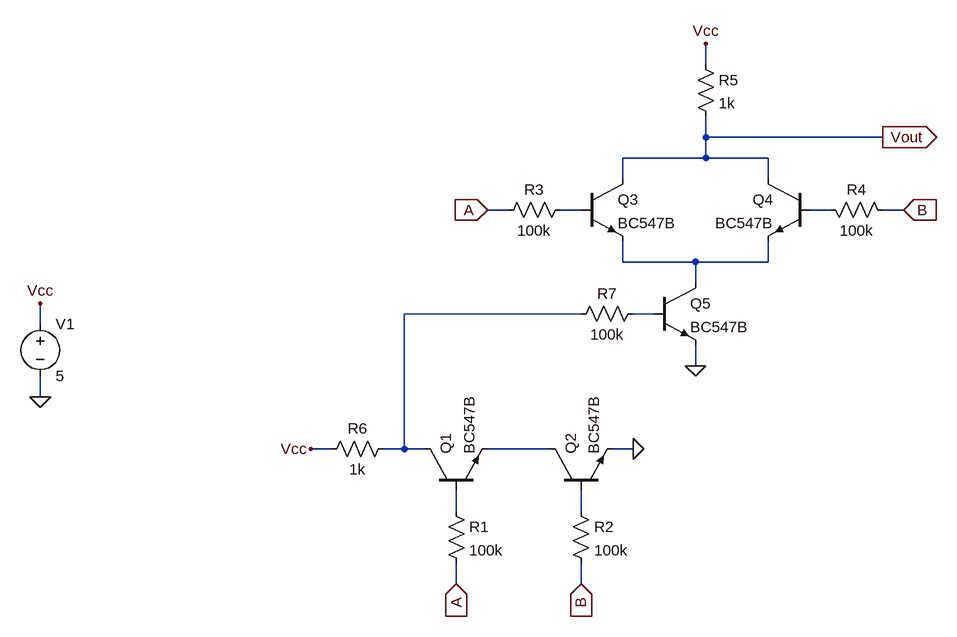
[diagram p0: schematic XNORgate.asc]
XNORgate.asc, the LTspice schematic file:
Version 4
SHEET 1 896 680
WIRE 496 -464 496 -496
WIRE 496 -352 496 -384
WIRE 768 -352 496 -352
WIRE 496 -320 496 -352
WIRE 496 -320 368 -320
WIRE 592 -320 496 -320
WIRE 368 -288 368 -320
WIRE 592 -288 592 -320
WIRE 192 -240 160 -240
WIRE 304 -240 272 -240
WIRE 688 -240 656 -240
WIRE 800 -240 768 -240
WIRE 368 -160 368 -192
WIRE 480 -160 368 -160
WIRE 592 -160 592 -192
WIRE 592 -160 480 -160
WIRE 480 -128 480 -160
WIRE 304 -80 32 -80
WIRE 416 -80 384 -80
WIRE -528 -64 -528 -96
WIRE 480 0 480 -32
WIRE -528 48 -528 16
WIRE -80 128 -112 128
WIRE 32 128 32 -80
WIRE 32 128 0 128
WIRE 64 128 32 128
WIRE 256 128 160 128
WIRE 384 128 352 128
WIRE 112 224 112 192
WIRE 304 224 304 192
WIRE 112 336 112 304
WIRE 304 336 304 304
FLAG -528 -96 Vcc
FLAG -112 128 Vcc
FLAG 496 -496 Vcc
FLAG -528 48 0
FLAG 384 128 0
FLAG 480 0 0
FLAG 160 -240 A
IOPIN 160 -240 In
FLAG 112 336 A
IOPIN 112 336 In
FLAG 304 336 B
IOPIN 304 336 In
FLAG 800 -240 B
IOPIN 800 -240 In
FLAG 768 -352 Vout
IOPIN 768 -352 Out
SYMBOL npn 64 192 R270
SYMATTR InstName Q1
SYMATTR Value BC547B
SYMBOL res 96 208 R0
SYMATTR InstName R1
SYMATTR Value 100k
SYMBOL npn 256 192 R270
SYMATTR InstName Q2
SYMATTR Value BC547B
SYMBOL res 288 208 R0
SYMATTR InstName R2
SYMATTR Value 100k
SYMBOL npn 304 -288 R0
SYMATTR InstName Q3
SYMATTR Value BC547B
SYMBOL res 288 -256 R90
WINDOW 0 0 56 VBottom 2
WINDOW 3 32 56 VTop 2
SYMATTR InstName R3
SYMATTR Value 100k
SYMBOL npn 656 -288 M0
SYMATTR InstName Q4
SYMATTR Value BC547B
SYMBOL res 672 -256 M90
WINDOW 0 0 56 VBottom 2
WINDOW 3 32 56 VTop 2
SYMATTR InstName R4
SYMATTR Value 100k
SYMBOL voltage -528 -80 R0
WINDOW 123 0 0 Left 0
WINDOW 39 0 0 Left 0
SYMATTR InstName V1
SYMATTR Value 5
SYMBOL npn 416 -128 R0
SYMATTR InstName Q5
SYMATTR Value BC547B
SYMBOL res 480 -480 R0
SYMATTR InstName R5
SYMATTR Value 1k
SYMBOL res 16 112 R90
WINDOW 0 0 56 VBottom 2
WINDOW 3 32 56 VTop 2
SYMATTR InstName R6
SYMATTR Value 1k
SYMBOL res 400 -96 R90
WINDOW 0 0 56 VBottom 2
WINDOW 3 32 56 VTop 2
SYMATTR InstName R7
SYMATTR Value 100k

The netlist it stands for:
* XNORgate.asc
Q1 N004 N007 N006 0 BC547B
R1 N007 A 100k
Q2 N006 N008 0 0 BC547B
R2 N008 B 100k
Q3 Vout N001 N003 0 BC547B
R3 N001 A 100k
Q4 Vout N002 N003 0 BC547B
R4 N002 B 100k
V1 Vcc 0 5
Q5 N003 N005 0 0 BC547B
R5 Vcc Vout 1k
R6 N004 Vcc 1k
R7 N005 N004 100k
.model NPN NPN
.model PNP PNP
.lib standard.bjt
.backanno
.end